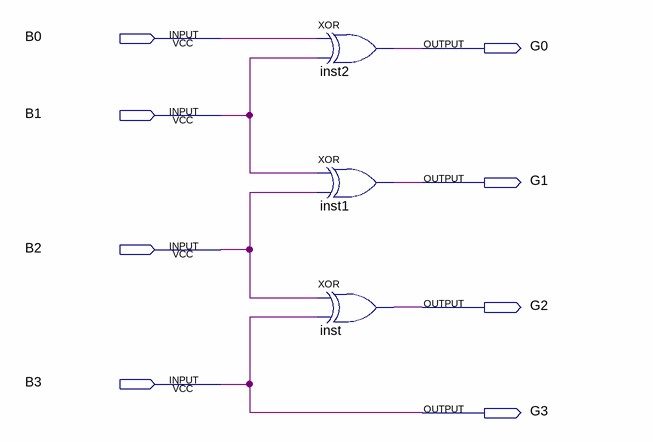
[diagram p0: schematic sheet]
// Quartus schematic Gray.bdf as structural Verilog: 3 symbols, 8 pins
module Gray (
  input  B0,
  input  B1,
  input  B2,
  input  B3,
  output G0,
  output G1,
  output G2,
  output G3
);

  xor inst2 (G0, B0, B1);
  xor inst1 (G1, B1, B2);
  xor inst (G2, B2, B3);

  assign G3 = B3;
endmodule
